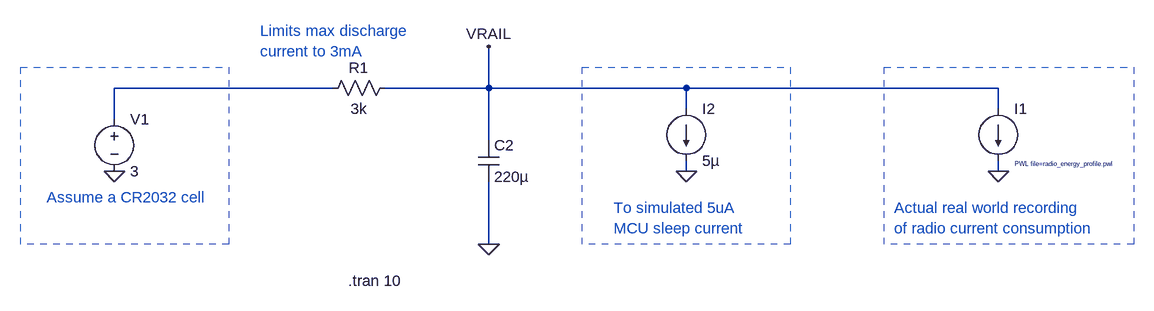
[diagram p0: schematic current_sim.asc]
current_sim.asc, the LTspice schematic file:
Version 4
SHEET 1 1032 680
WIRE -208 192 -544 192
WIRE 32 192 32 128
WIRE 32 192 -128 192
WIRE 336 192 32 192
WIRE 816 192 336 192
WIRE 336 224 336 192
WIRE 816 224 816 192
WIRE -544 240 -544 192
WIRE 32 272 32 192
WIRE 336 320 336 304
WIRE 816 320 816 304
WIRE 32 432 32 336
FLAG -544 320 0
FLAG 816 320 0
FLAG 32 432 0
FLAG 336 320 0
FLAG 32 128 VRAIL
SYMBOL load2 816 224 R0
WINDOW 3 25 84 Left 0
WINDOW 123 0 0 Left 0
WINDOW 39 0 0 Left 0
SYMATTR Value PWL file=radio_energy_profile.pwl
SYMATTR InstName I1
SYMBOL cap 16 272 R0
SYMATTR InstName C2
SYMATTR Value 220µ
SYMBOL load2 336 224 R0
WINDOW 123 0 0 Left 0
WINDOW 39 0 0 Left 0
SYMATTR InstName I2
SYMATTR Value 5µ
SYMBOL voltage -544 224 R0
WINDOW 123 0 0 Left 0
WINDOW 39 0 0 Left 0
SYMATTR InstName V1
SYMATTR Value 3
SYMBOL res -224 208 R270
WINDOW 0 32 56 VTop 2
WINDOW 3 0 56 VBottom 2
SYMATTR InstName R1
SYMATTR Value 3k
TEXT -184 488 Left 2 !.tran 10
TEXT -648 360 Left 2 ;Assume a CR2032 cell
TEXT -320 104 Left 2 ;Limits max discharge \ncurrent to 3mA
TEXT 224 376 Left 2 ;To simulated 5uA\nMCU sleep current
TEXT 656 376 Left 2 ;Actual real world recording\nof radio current consumption
RECTANGLE Normal -368 432 -688 160 2
RECTANGLE Normal 496 432 176 160 2
RECTANGLE Normal 1024 432 640 160 2

The netlist it stands for:
* current_sim.asc
I1 VRAIL 0 PWL file=radio_energy_profile.pwl
C2 VRAIL 0 220µ
I2 VRAIL 0 5µ
V1 N001 0 3
R1 N001 VRAIL 3k
.tran 10
* Assume a CR2032 cell
* Limits max discharge
* current to 3mA
* To simulated 5uA
* MCU sleep current
* Actual real world recording
* of radio current consumption
.backanno
.end